# EAGLE design AD5933_breakout (EAGLE 9.0.0)
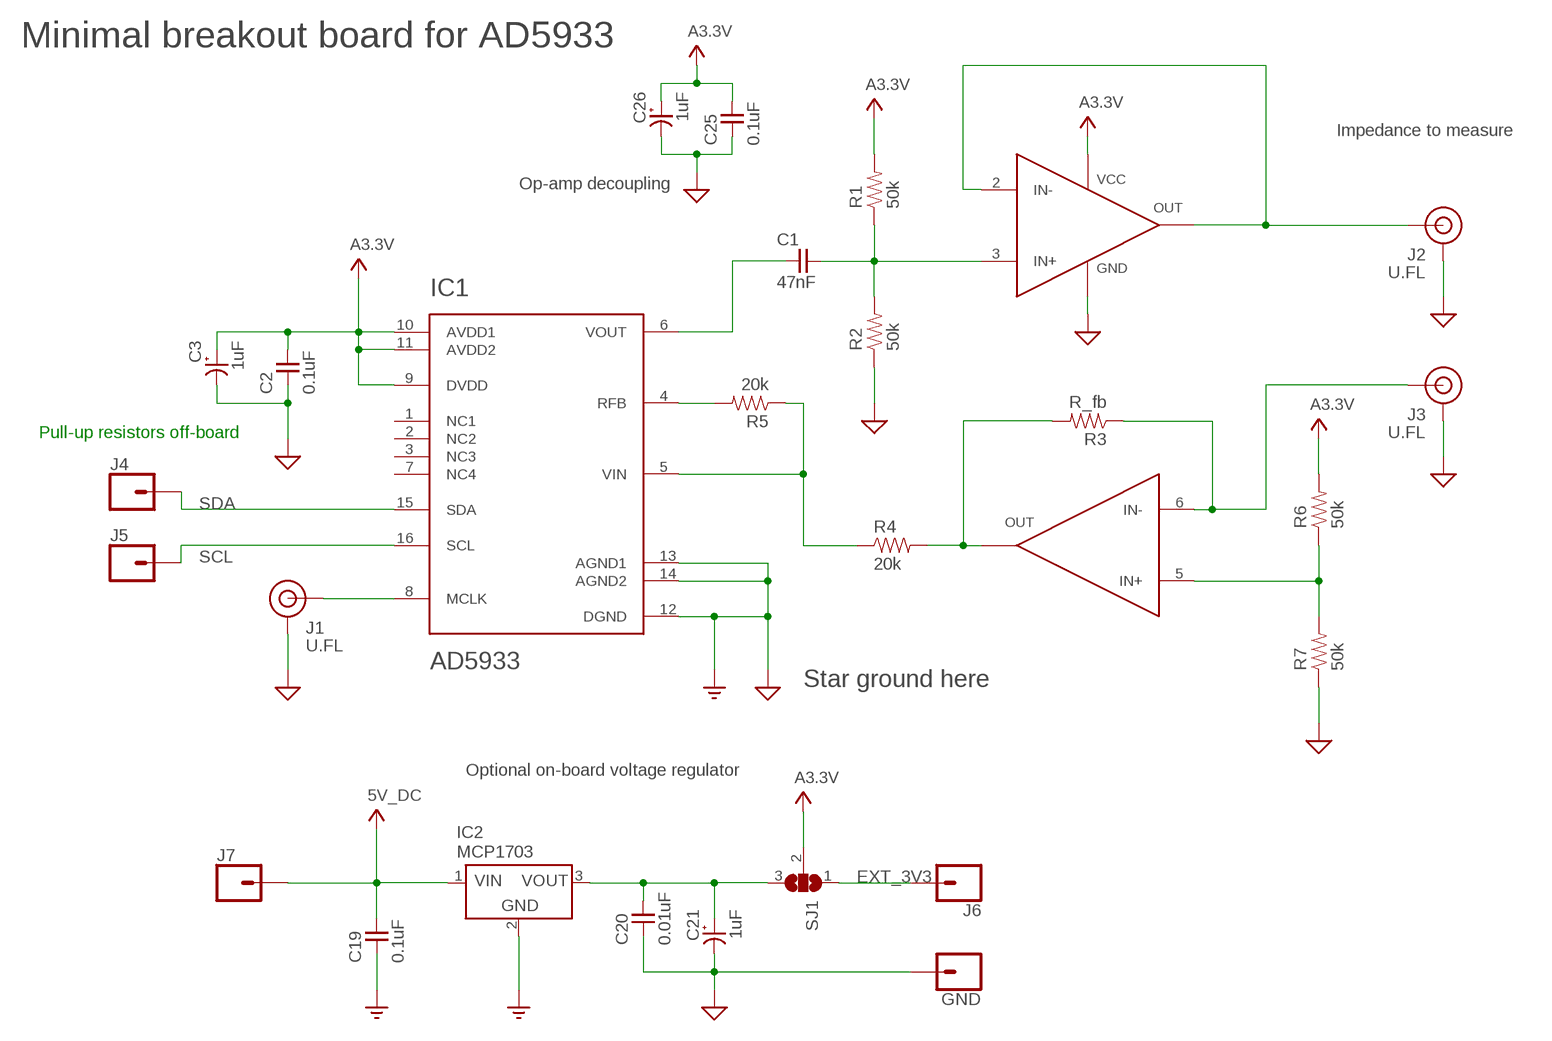
[diagram p0: schematic, sheet 1]

## Parts
C1  47nF  CAPACITOR0805  [0805]
C2  0.1uF  CAPACITOR0805  [0805]
C3  1uF  CAPACITOR+  [1206]
C19  0.1uF  CAPACITOR0805  [0805]
C20  0.01uF  CAPACITOR0805  [0805]
C21  1uF  CAPACITOR+  [1206]
C25  0.1uF  CAPACITOR0805  [0805]
C26  1uF  CAPACITOR+  [1206]
GND  CONN_01PTH_NO_SILK_YES_STOP  [1X01_NO_SILK]
IC1  AD5933  [SSOP_16]
IC2  MCP1703  [SOT-23A]
IC8  AD8606SOIC_8  [SO_8]
J1  U.FL  U.FL2PIN  [U.FL]
J2  U.FL  U.FL2PIN  [U.FL]
J3  U.FL  U.FL2PIN  [U.FL]
J4  CONN_01PTH_NO_SILK_YES_STOP  [1X01_NO_SILK]
J5  CONN_01PTH_NO_SILK_YES_STOP  [1X01_NO_SILK]
J6  CONN_01PTH_NO_SILK_YES_STOP  [1X01_NO_SILK]
J7  CONN_01PTH_NO_SILK_YES_STOP  [1X01_NO_SILK]
R1  50k  RESISTORSMD0805  [0805]
R2  50k  RESISTORSMD0805  [0805]
R3  R_fb  RESISTORSMD0805  [0805]
R4  20k  RESISTORSMD0805  [0805]
R5  20k  RESISTORSMD0805  [0805]
R6  50k  RESISTORSMD0805  [0805]
R7  50k  RESISTORSMD0805  [0805]
SJ1  SJ2W  [SJ_2]

## Nets
3V3: C2.2 C3.1 C25.2 C26.1 IC1.9(DVDD) IC1.10(AVDD1) IC1.11(AVDD2) IC8.8(VCC) R1.2 R6.2 SJ1.2 ; supply symbol labelled A3.3V
5V_DC: C19.2 IC2.1(VIN) J7.1
EXT_3V3: J6.1 SJ1.1
GND: C2.1 C3.2 C19.1 C20.1 C21.2 C25.1 C26.2 GND.1 IC1.12(DGND) IC1.13(AGND1) IC1.14(AGND2) IC2.2(GND) IC8.4(GND) J1.1(GND) J1.2(GND) J2.1(GND) J2.2(GND) J3.1(GND) J3.2(GND) R2.1 R7.1 ; supply symbol labelled AGND
INT_3V3: C20.2 C21.1 IC2.3(VOUT) SJ1.3
N$1: C1.2 IC8.3(IN+) R1.1 R2.2
N$2: IC8.1(OUT) IC8.2(IN-) J2.FEED(SIGNAL)
N$3: IC8.6(IN-) J3.FEED(SIGNAL) R3.1
N$4: IC8.7(OUT) R3.2 R4.2
N$5: IC8.5(IN+) R6.1 R7.2
N$6: IC1.4(RFB) R5.2
N$7: IC1.5(VIN) R4.1 R5.1
N$8: C1.1 IC1.6(VOUT)
N$37: IC1.8(MCLK) J1.FEED(SIGNAL)
SCL: IC1.16(SCL) J5.1
SDA: IC1.15(SDA) J4.1
Unconnected: IC1.1(NC1) IC1.2(NC2) IC1.3(NC3) IC1.7(NC4)

## Notes on the sheet
- Minimal breakout board for AD5933
- Impedance to measure
- Op-amp decoupling
- Pull-up resistors off-board
- Star ground here
- Optional on-board voltage regulator

## Library data of the parts
C1 C2 C19 C20 C25 = thomas:CAPACITOR: This is a capacitor
C3 C21 C26 = thomas:CAPACITOR+: This is a polarized capacitor
GND J4-J7 = SparkFun-Connectors:CONN_01: Single connection point. Often used as Generic Header-pin footprint for 0.1 inch spaced/style header connections On any of the 0.1 inch spaced packages, you can populate with these: Break Away Headers - Straight <https://www.sparkfun.com/products/116> (PRT-00116) Break Away Male Headers - Right Angle <https://www.sparkfun.com/products/553> (PRT-00553) Female Headers <https://www.sparkfun.com/products/115> (PRT-00115) Break Away Headers - Machine Pin <https://www.sparkfun.com/products/117> (PRT-00117) Break Away Female Headers - Swiss Machine Pin <https://www.sparkfun.com/products/743> (PRT-00743) This device is also useful as a general connection point to wire up your design to another part of your project. Our various solder wires solder well into these plated through hole pads. Hook-Up Wire - Assortment (Stranded, 22 AWG) <https://www.sparkfun.com/products/11375> (PRT-11375) Hook-Up Wire - Assortment (Solid Core, 22 AWG) <https://www.sparkfun.com/products/11367> (PRT-11367) View the entire wire category on our website here <https://www.sparkfun.com/categories/141> Special notes: SMTSO-256-ET is a "flush mount" nut for a 4-40 screw. We mostly use this on specialty testbeds; it is a nice way to connect hardware to your PCB at an adjustable hieght. Also note, the SNAP packages are for using a snappable style connector. We sell a baggie of snaps and they are also used on two LilyPad designs: Snap Assortment - 30 pack (male and female) <https://www.sparkfun.com/products/11347> (DEV-11347) LilyPad Arduino SimpleSnap <https://www.sparkfun.com/products/10941> (DEV-10941) LilyPad SimpleSnap Protoboard <https://www.sparkfun.com/products/10940> (DEV-10940)
IC1 = thomas:AD5933: The AD5933 is a complete integrated network analyzer from Analog Devices
IC2 = thomas:MCP1703: The MCP1703 is a LDO regulator from Microchip
IC8 = thomas:AD8606: The AD8606 is a dual op-amp from Analog Devices.
J1-J3 = SparkFun-Connectors:U.FL2PIN: SMD Antenna Connector - U.FL 2mm height, 3.0mm x 3.0mm receptacle size. SparkFun Products: SparkFun WiFi Shield - ESP8266 <https://www.sparkfun.com/products/13287> SparkFun ESP8266 Thing <https://www.sparkfun.com/products/13231> SparkFun MiniGen - Pro Mini Signal Generator Shield <https://www.sparkfun.com/products/11420>; PROD_ID: CONN-09193; SF_ID: WRL-09144
R1-R7 = thomas:RESISTOR: This is a resistor
SJ1 = jumper:SJ2W: SMD solder JUMPER

## Board
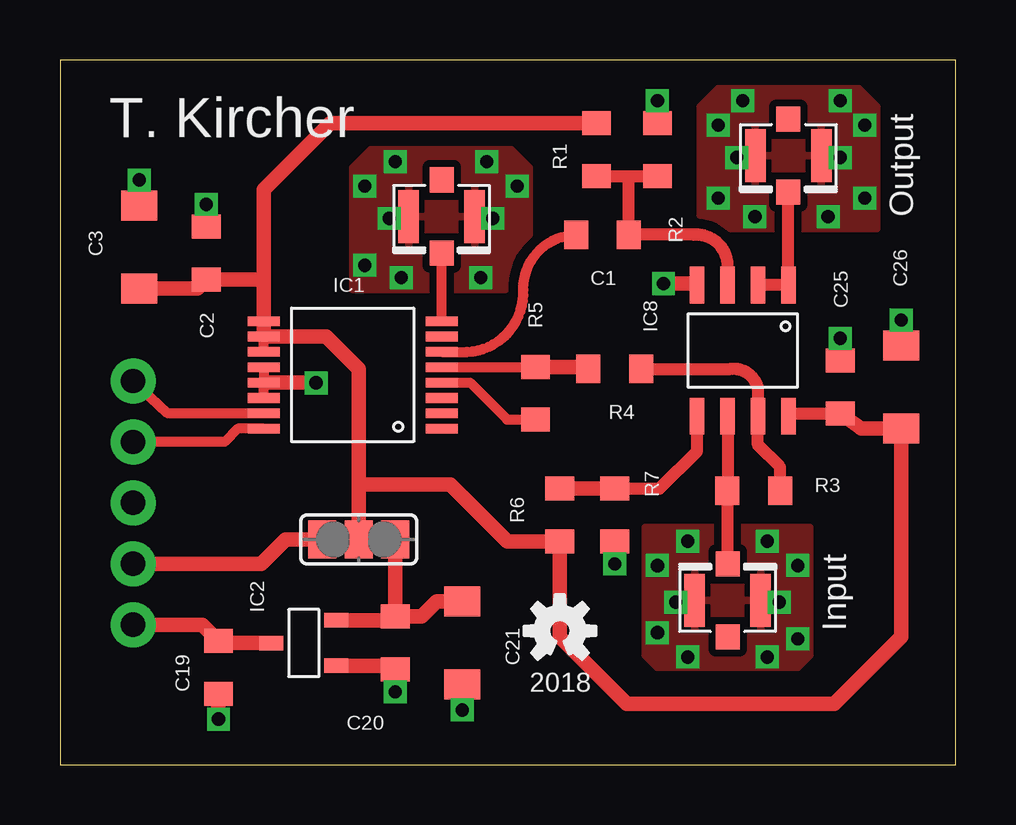
[diagram p1: board, top side]
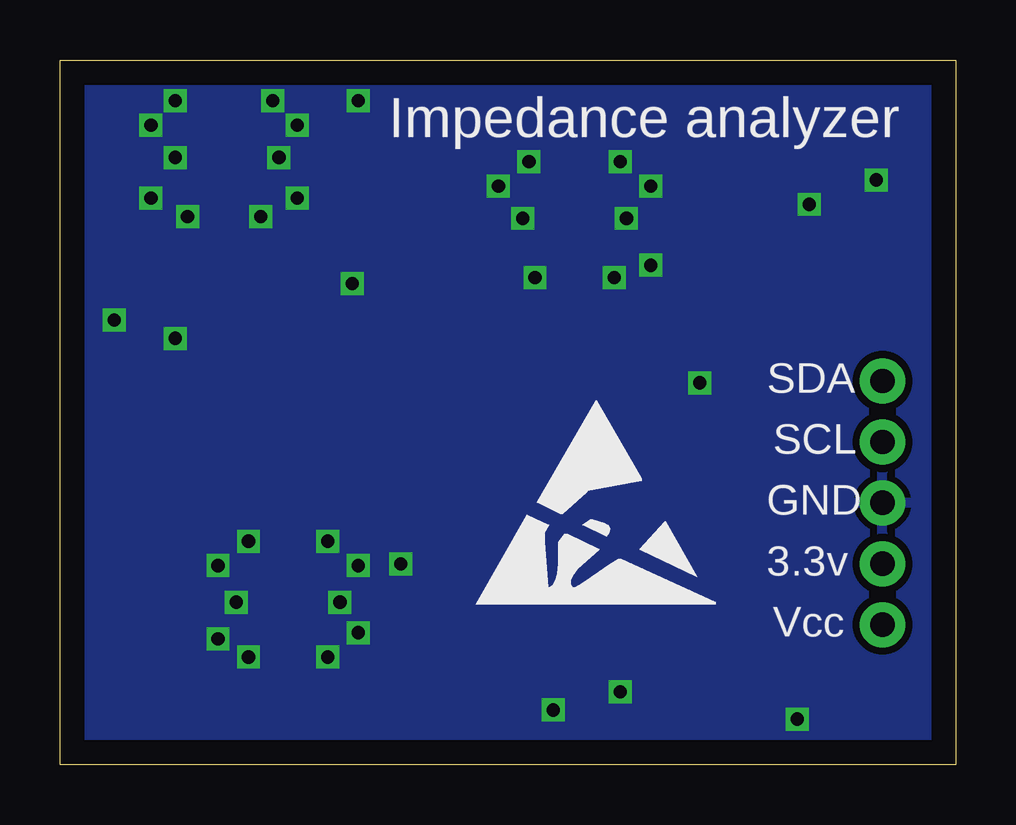
[diagram p2: board, bottom side, seen from below]

Size 37.32 x 29.39 mm. Coordinates in mm from the lower left corner, seen from the top.
Outline: 0,0 37.32,0 37.32,29.39 0,29.39 0,0
Copper layers (1*16): Top 0.035mm / dielectric 1.5mm / Bottom 0.035mm
Design rules "default": minimum track width 6mil, minimum drill 0.35mm, track to track 6mil, track to pad 6mil, pad to pad 6mil, via to via 6mil, smd to smd 6mil, copper to edge 40mil, drill to drill 6mil, minimum pad ring 10mil, minimum via ring 8mil, stop-mask expansion 4mil, vias tented up to drill 0mil, thermal gap 10mil

### Footprints (pad centres in the part's own frame; a part is rotated, then mirrored left to right if it is on the bottom)
0805 = smd 1 x 1.2: 1 -1.1,0; 2 1.1,0
1206 = smd 1.25 x 1.5: 1 -1.725,0; 2 1.725,0
1X01_NO_SILK = drill 1.016 pad 1.88: 1 0,0
SSOP_16 = smd 0.4 x 1.341: 1 -2.24,-3.708; 2 -1.6,-3.708; 3 -0.96,-3.708; 4 -0.32,-3.708; 5 0.32,-3.708; 6 0.96,-3.708; 7 1.6,-3.708; 8 2.24,-3.708; 9 2.24,3.708; 10 1.6,3.708; 11 0.96,3.708; 12 0.32,3.708; 13 -0.32,3.708; 14 -0.96,3.708; 15 -1.6,3.708; 16 -2.24,3.708
SOT-23A = smd 0.6 x 1: 1 0,1.35; 2 -0.95,-1.35; 3 0.95,-1.35
SO_8 = smd 1.524 x 0.61: 1 -2.731,1.905; 2 -2.731,0.635; 3 -2.731,-0.635; 4 -2.731,-1.905; 5 2.731,-1.905; 6 2.731,-0.635; 7 2.731,0.635; 8 2.731,1.905
U.FL = smd 2.2 x 0.85: 1 0,1.375; 2 0,-1.375 | smd 1.05 x 1: FEED 1.525,0; NC -1.525,0
SJ_2 = smd 1.168 x 1.6: 1 -1.524,0; 2 0,0; 3 1.524,0

### Placement (x,y rotation side)
C1  22.61,22.1 0 top
C2  6.1,21.34 270 top
C3  3.3,21.59 90 top
C19  6.6,4.06 90 top
C20  13.97,5.08 90 top
C21  16.76,5.08 270 top
C25  32.51,15.75 270 top
C26  35.05,15.75 90 top
GND  3.05,10.92 90 top
IC1  12.19,16.26 90 top
IC2  10.16,5.08 90 top
IC8  28.45,17.27 270 top
J1  15.9,22.86 270 top
J2  30.35,25.4 270 top
J3  27.81,6.86 90 top
J4  3.05,16 0 top
J5  3.05,13.46 0 top
J6  3.05,8.38 90 top
J7  3.05,5.84 0 top
R1  22.35,25.65 90 top
R2  24.89,25.65 270 top
R3  28.91,11.43 0 top
R4  23.11,16.51 0 top
R5  19.81,15.49 270 top
R6  20.83,10.41 270 top
R7  23.11,10.41 90 top
SJ1  12.45,9.4 0 top
U$13  [OSHW-LOGO-S]  20.83,5.59 0 top
U$14  [ESD_10.00]  20.07,6.6 0 bottom

### Tracks (layer width: path | path; a pad name or v marks a point on that pad's centre or on a via)
3V3
  Top 0.406: IC1.11 IC1.10 | IC8.8 30.46,14.65 | 8.4,20.24 8.48,19.56
  Top 0.508: 30.46,14.65 C25.2
  Top 0.61: R1.2 11.26,26.75 8.48,23.98 8.48,20.07 | 8.48,20.07 8.48,19.56 IC1.9 IC1.10 11.1,17.86 12.45,16.51 12.45,11.68 | C25.2 33.39,14.02 C26.1 35.05,5.33 32.26,2.54 23.62,2.54 20.83,5.33 R6.2 18.63,9.31 16.26,11.68 12.45,11.68 | SJ1.2 12.45,11.68 | 8.48,20.07 8.31,20.24 C2.2 5.73,19.87 C3.1
5V_DC
  Top 0.61: J7.1 5.93,5.84 C19.2 6.69,5.08 IC2.1
EXT_3V3
  Top 0.61: SJ1.1 9.4,9.4 8.38,8.38 J6.1
GND  (via drill 0.55)
  Top 0.406: IC1.12 IC1.13 IC1.14 | C25.1 v32.51,17.78 | C26.2 v35.05,18.54
  Top 0.508: J1.2 13.79,22.61 v13.72,22.78 | J1.1 17.96,22.61 v18.03,22.78 | J2.2 28.27,25.15 v28.19,25.32 | J2.1 32.44,25.15 v32.51,25.32 | J3.2 29.9,6.86 v29.97,6.78 | J3.1 26.24,6.86 v25.65,6.78
  Top 0.61: IC2.2 13.82,4.13 C20.1 v13.97,3.05 | C19.1 v6.6,1.91 | C21.2 v16.76,2.29 | C2.1 v6.1,23.37 | C3.2 v3.3,24.38 | IC1.13 10.42,15.94 v10.67,15.93 | R2.1 v24.89,27.69 | IC8.4 26.48,20.07 v25.15,20.07 | R7.1 v23.11,8.38
  other vias: 27.43,26.67 28.45,27.69 32,22.86 28.96,22.86 27.43,23.62 32.51,27.69 33.53,26.67 33.53,23.62 26.16,9.32 24.89,8.31 24.89,5.51 29.46,9.32 30.73,8.31 30.73,5.26 29.46,4.5 26.16,4.5 17.53,20.32 14.22,20.32 12.7,24.13 12.7,20.83 19.05,24.13 17.78,25.15 13.97,25.15
  pour Bottom (isolate 0.305): 0,29.21 37.34,29.21 37.34,0 0,0
  pour Top (isolate 0.305): 24.38,9.91 24.38,4.57 24.89,4.06 30.73,4.06 31.24,4.57 31.24,9.91
  pour Top (isolate 0.305): 34.04,22.35 34.04,27.43 33.27,28.19 27.43,28.19 26.67,27.43 26.67,22.91 arc-40 27.94,22.35
  pour Top (isolate 0.305): 19.56,22.1 19.56,24.89 18.8,25.65 12.95,25.65 12.19,24.89 12.19,19.81 18.54,19.81 arc-55
INT_3V3
  Top 0.61: IC2.3 13.82,6.03 C20.2 | SJ1.3 C20.2 | C20.2 15.07,6.18 15.7,6.8 C21.1
N$1
  Top 0.406: 23.71,24.47 22.61,24.55
  Top 0.508: IC8.3 27.81,20.93 arc90 26.39,22.1 C1.2 23.71,24.47 | R1.1 22.61,24.55 R2.2
N$2
  Top 0.508: J2.FEED IC8.1 IC8.2
N$3
  Top 0.508: IC8.6 R3.1 27.8,8.65 J3.FEED
N$4
  Top 0.508: R4.2 27.94,16.51 arc-90 29.08,15.62 IC8.7 29.08,13.34 30.01,12.41 R3.2
N$5
  Top 0.508: IC8.5 26.54,13.08 24.98,11.51 R7.2
  Top 0.61: R6.1 R7.2
N$6
  Top 0.406: R5.2 18.63,14.39 17.08,15.94 IC1.4
N$7
  Top 0.406: IC1.5 19.79,16.58 R5.1 | 22.18,16.59 R4.1
  Top 0.61: R5.1 22.18,16.59
N$8
  Top 0.406: IC1.6 16.96,17.22 arc90 19.3,19.81 arc-90 C1.1
N$37
  Top 0.406: IC1.8 J1.FEED
SCL
  Top 0.406: IC1.16 7.41,14.02 6.86,13.46 J5.1
SDA
  Top 0.406: IC1.15 4.5,14.66 J4.1

### Text on the board
tNames: T. Kircher | Output | Input | 2018
bNames: Impedance analyzer | SDA | SCL | GND | 3.3v | Vcc